# EAGLE design simple-servo (EAGLE 8.5.2)
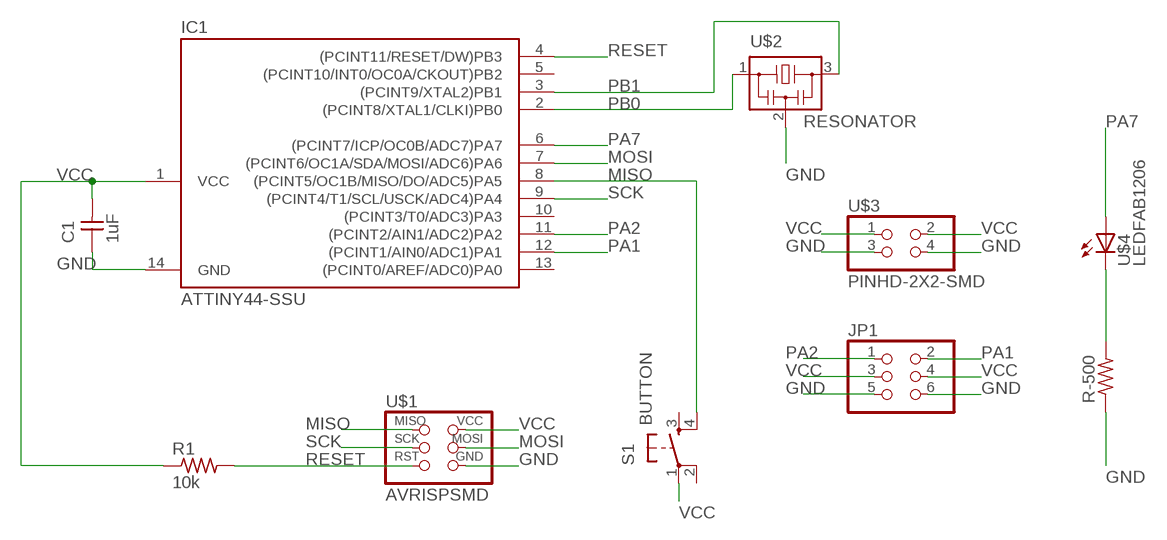
[diagram p0: schematic, sheet 1]

## Parts
C1  1uF  CAP-UNPOLARIZEDFAB  [C1206FAB]
IC1  ATTINY44-SSU  [SOIC14]
JP1  PINHD-2X3-SMD  [2X03SMD]
R1  10k  RES-US1206FAB  [R1206FAB]
R-500  RES-US1206FAB  [R1206FAB]
S1  BUTTON  6MM_SWITCH6MM_SWITCH  [6MM_SWITCH]
U$1  AVRISPSMD  [2X03SMD]
U$2  RESONATOR  [EFOBM]
U$3  PINHD-2X2-SMD  [2X02SMD]
U$4  LEDFAB1206  [LED1206FAB]

## Nets
GND: C1.1 IC1.14(GND) JP1.5 JP1.6 R-500.1 U$1.6(GND) U$2.2 U$3.3 U$3.4
MISO: IC1.8((PCINT5/OC1B/MISO/DO/ADC5)PA5) S1.4(S1) U$1.1(MISO)
MOSI: IC1.7((PCINT6/OC1A/SDA/MOSI/ADC6)PA6) U$1.4(MOSI)
N$1: R-500.2 U$4.2(C)
PA1: IC1.12((PCINT1/AIN0/ADC1)PA1) JP1.2
PA2: IC1.11((PCINT2/AIN1/ADC2)PA2) JP1.1
PA7: IC1.6((PCINT7/ICP/OC0B/ADC7)PA7) U$4.1(A)
PB0: IC1.2((PCINT8/XTAL1/CLKI)PB0) U$2.1
PB1: IC1.3((PCINT9/XTAL2)PB1) U$2.3
RESET: IC1.4((PCINT11/RESET/DW)PB3) R1.2 U$1.5(RST)
SCK: IC1.9((PCINT4/T1/SCL/USCK/ADC4)PA4) U$1.3(SCK)
VCC: C1.2 IC1.1(VCC) JP1.3 JP1.4 R1.1 S1.1(P) U$1.2(VCC) U$3.1 U$3.2
Unconnected: IC1.5((PCINT10/INT0/OC0A/CKOUT)PB2) IC1.10((PCINT3/T0/ADC3)PA3) IC1.13((PCINT0/AREF/ADC0)PA0) S1.2(P1) S1.3(S)

## Library data of the parts
C1 = fab:CAP-UNPOLARIZED
IC1 = fab:ATTINY44
JP1 = fab:PINHD-2X3-SMD: PIN HEADER
R1 R-500 = fab:RES-US: Resistor (US Symbol) Variants with postfix FAB are widened to allow the routing of internal traces
S1 = fab:6MM_SWITCH: OMRON SWITCH
U$1 = fab:AVRISP
U$2 = fab:RESONATOR
U$3 = fab:PINHD-2X2-SMD
U$4 = fab:LED: LED

## Board
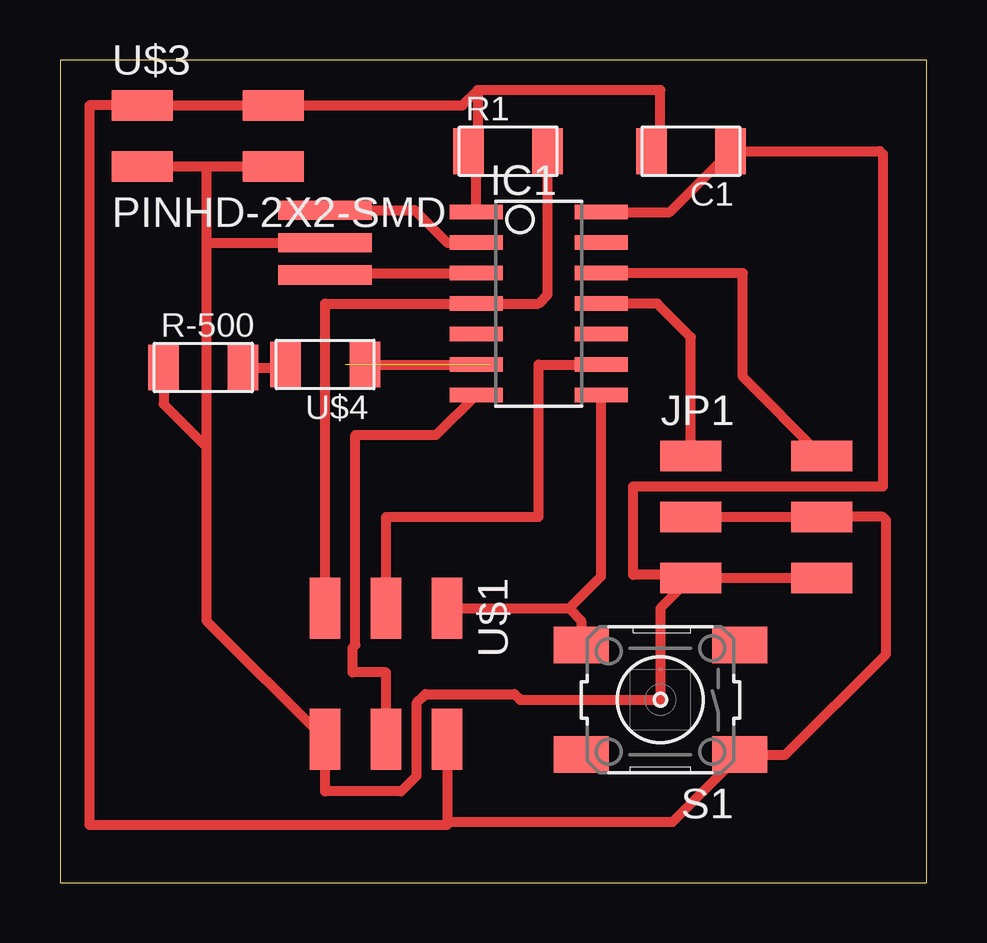
[diagram p1: board, top side]

Size 36.12 x 34.28 mm. Coordinates in mm from the lower left corner, seen from the top.
Outline: 0,0 36.12,0 36.12,34.28 0,34.28 0,0
Copper layers (1*16): Top 0.035mm / dielectric 1.5mm / Bottom 0.035mm
Design rules "fabmodule": minimum track width 10mil, minimum drill 0.4mm, track to track 0.42mm, track to pad 0.42mm, pad to pad 0.42mm, via to via 0.42mm, smd to smd 0.42mm, copper to edge 40mil, drill to drill 0.8mm, minimum pad ring 10mil, minimum via ring 8mil, stop-mask expansion 4mil, vias tented up to drill 0mil, thermal gap 10mil

### Footprints (pad centres in the part's own frame; a part is rotated, then mirrored left to right if it is on the bottom)
C1206FAB = smd 1.27 x 1.905: 1 -1.651,0; 2 1.651,0
SOIC14 = smd 0.61 x 2.21: 1 -3.81,-2.603; 2 -2.54,-2.603; 3 -1.27,-2.603; 4 0,-2.603; 5 1.27,-2.603; 6 2.54,-2.603; 7 3.81,-2.603; 8 3.81,2.603; 9 2.54,2.603; 10 1.27,2.603; 11 0,2.603; 12 -1.27,2.603; 13 -2.54,2.603; 14 -3.81,2.603
2X03SMD = smd 2.54 x 1.27: 1 -2.54,2.54; 2 2.92,2.54; 3 -2.54,0; 4 2.92,0; 5 -2.54,-2.54; 6 2.92,-2.54
R1206FAB = smd 1.27 x 1.905: 1 -1.651,0; 2 1.651,0
6MM_SWITCH = smd 2.286 x 1.524: 1 -3.302,2.286; 2 3.302,2.286; 3 -3.302,-2.286; 4 3.302,-2.286
EFOBM = smd 0.8 x 3.9: 1 -1.35,0; 2 0,0; 3 1.35,0
2X02SMD = smd 2.54 x 1.27: 1 -2.54,1.27; 2 2.92,1.27; 3 -2.54,-1.27; 4 2.92,-1.27
LED1206FAB = smd 1.27 x 1.905: 1 -1.651,0; 2 1.651,0

### Placement (x,y rotation side)
C1  26.29,30.48 180 top
IC1  19.94,24.13 270 top
JP1  28.83,15.24 0 top
R1  18.67,30.48 0 top
R-500  5.97,21.46 0 top
S1  25.02,7.62 180 top
U$1  13.59,8.89 270 top
U$2  11.05,26.67 270 top
U$3  5.97,31.11 0 top
U$4  11.05,21.59 180 top

### Tracks (layer width: path | path; a pad name or v marks a point on that pad's centre or on a via)
GND
  Top 0.406: U$3.3 6.1,29.84 | 6.1,29.84 U$3.4 | 6.1,29.84 6.1,26.67 | 6.1,26.67 U$2.2 | 6.1,26.67 6.1,18.16 | 6.1,18.16 6.1,10.92 U$1.6 11.05,3.81 14.22,3.81 14.85,4.44 14.85,7.48 15.24,7.86 18.93,7.86 19.18,7.62 25.02,7.62 25.02,11.43 JP1.5 | JP1.5 JP1.6 | JP1.5 26.16,12.83 23.88,12.83 23.88,16.51 34.29,16.51 34.29,30.35 34.16,30.48 C1.1 25.4,27.94 IC1.14 | R-500.1 4.32,19.94 6.1,18.16
MISO
  Top 0.406: U$1.1 21.21,11.43 | 21.21,11.43 21.72,10.92 S1.4 | 21.21,11.43 22.54,12.76 IC1.8
MOSI
  Top 0.406: U$1.4 13.59,8.76 12.19,8.76 12.19,9.79 12.31,9.9 12.31,18.66 15.67,18.66 IC1.7
N$1
  Top 0.406: R-500.2 9.27,21.46 U$4.2
PA1
  Top 0.406: JP1.2 28.45,21.08 28.45,25.4 IC1.12
PA2
  Top 0.406: JP1.1 26.29,22.73 24.89,24.13 IC1.11 21.84,24.13
PA7  (2 unrouted)
  Top 0.406: U$4.1 IC1.6
PB0
  Top 0.406: 11.13,27.94 U$2.1 14.78,28.02 16.13,26.67 IC1.2
PB1
  Top 0.406: U$2.3 11.13,25.4 IC1.3
RESET
  Top 0.406: R1.2 20.32,24.51 19.94,24.13 IC1.4 11.05,24.13 U$1.5
SCK
  Top 0.406: IC1.9 19.94,21.59 19.94,15.24 13.59,15.24 U$1.3
VCC
  Top 0.406: U$1.2 16.13,2.54 16.26,2.54 | 17.4,33.02 25.02,33.02 25.02,30.86 C1.2 | 17.4,33.02 17.4,30.86 17.21,30.67 | 17.21,30.67 R1.1 | IC1.1 17.34,30.54 17.21,30.67 | 17.4,33.02 16.76,32.39 U$3.2 U$3.1 1.22,32.39 1.22,2.41 16.13,2.41 16.26,2.54 | JP1.3 31.37,15.24 JP1.4 | 32.26,15.11 32.13,15.24 JP1.4 | 28.45,5.21 S1.1 | 16.26,2.54 25.53,2.54 S1.1 | S1.1 30.23,5.33 34.42,9.52 34.42,15.11 34.29,15.24 JP1.4